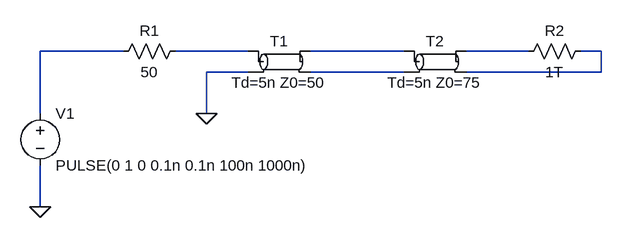
[diagram p0: schematic Draft2.asc]
Draft2.asc, the LTspice schematic file:
Version 4.1
SHEET 1 880 680
WIRE 128 16 0 16
WIRE 320 16 208 16
WIRE 560 16 416 16
WIRE 752 16 656 16
WIRE 864 16 832 16
WIRE 320 48 256 48
WIRE 560 48 416 48
WIRE 864 48 864 16
WIRE 864 48 656 48
WIRE 0 112 0 16
WIRE 256 112 256 48
WIRE 0 256 0 192
FLAG 0 256 0
FLAG 256 112 0
SYMBOL voltage 0 96 R0
WINDOW 123 0 0 Left 0
WINDOW 39 0 0 Left 0
SYMATTR InstName V1
SYMATTR Value PULSE(0 1 0 0.1n 0.1n 100n 1000n)
SYMBOL res 224 0 R90
WINDOW 0 0 56 VBottom 2
WINDOW 3 32 56 VTop 2
SYMATTR InstName R1
SYMATTR Value 50
SYMBOL tline 368 32 R0
SYMATTR InstName T1
SYMATTR Value Td=5n Z0=50
SYMBOL tline 608 32 R0
SYMATTR InstName T2
SYMATTR Value Td=5n Z0=75
SYMBOL res 848 0 R90
WINDOW 0 0 56 VBottom 2
WINDOW 3 32 56 VTop 2
SYMATTR InstName R2
SYMATTR Value 1T

The netlist it stands for:
* Draft2.asc
V1 N001 0 PULSE(0 1 0 0.1n 0.1n 100n 1000n)
R1 N002 N001 50
T1 N002 0 N003 N006 Td=5n Z0=50
T2 N003 N006 N004 N005 Td=5n Z0=75
R2 N005 N004 1T
.backanno
.end